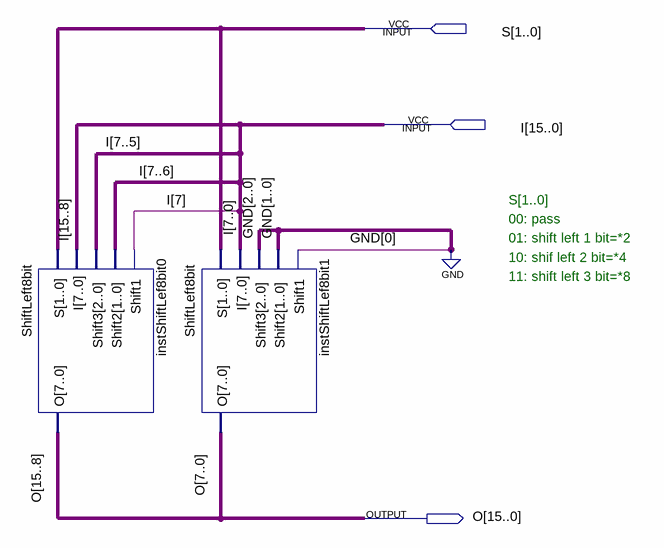
[diagram p0: schematic sheet]
// Quartus schematic ShiftLeft16bit.bdf as structural Verilog: 2 symbols, 3 pins
module ShiftLeft16bit (
  input  [1:0] S,
  input  [15:0] I,
  output [15:0] O
);

  ShiftLeft8bit instShiftLef8bit0 (.S(S), .I(I[15:8]), .Shift3(I[7:5]), .Shift2(I[7:6]), .Shift1(I[7]), .O(O[15:8]));
  ShiftLeft8bit instShiftLef8bit1 (.S(S), .I(I[7:0]), .Shift3(3'b000), .Shift2(2'b00), .Shift1(1'b0), .O(O[7:0]));

  // Notes on the sheet:
  //   S[1..0]
  //   00: pass
  //   01: shift left 1 bit=*2
  //   10: shif left 2 bit=*4
  //   11: shift left 3 bit=*8
endmodule
